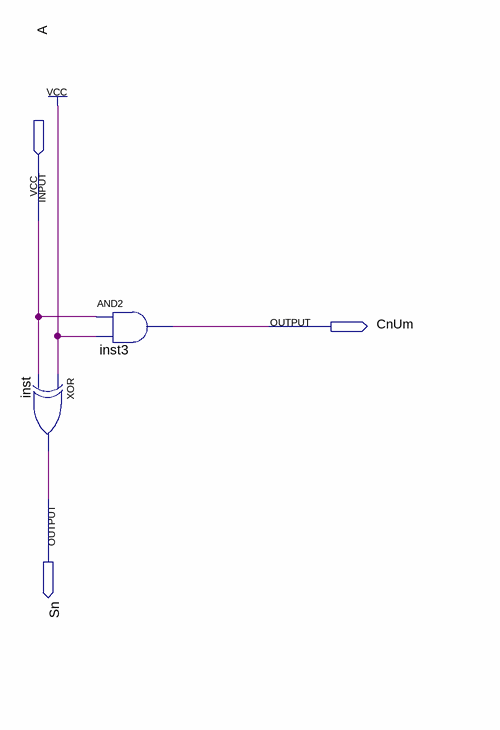
[diagram p0: schematic sheet]
// Quartus schematic somaUmOK.bdf as structural Verilog: 2 symbols, 3 pins
module somaUmOK (
  input  A,
  output CnUm,
  output Sn
);

  xor inst (Sn, 1'b1, A);
  and inst3 (CnUm, A, 1'b1);
endmodule
